# Altium schematic sheet CAN_Module.SchDoc: MCP2515 CAN Bus Module
size A4; Date: 3/3/2026; Author: Yasir Shahzad; CompanyName: mastermind; DrawnBy: Yasir Shahzad; Organization: mastermind; Revision: 1.01; SheetNumber: 1; SheetTotal: 1
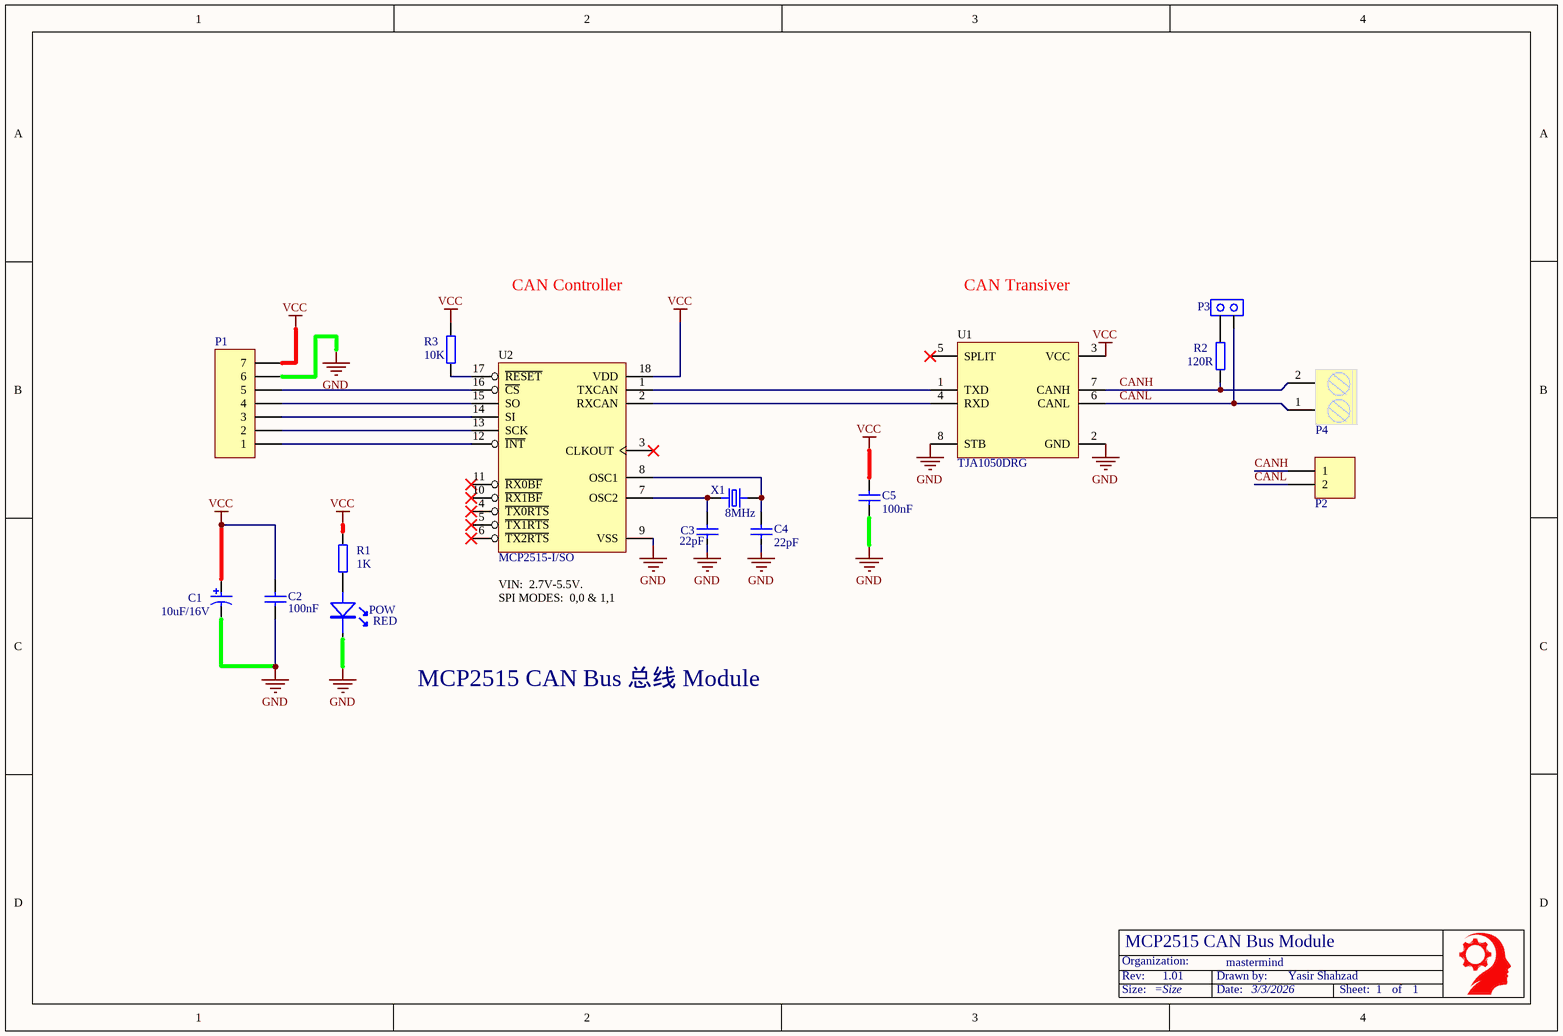
[diagram p0: CAN_Module.SchDoc]

## Parts
*  TitleBlock  (value not drawn)  (graphical)
C1  10uF/16V  [tantalum  A]  (value not drawn)
C2  100nF  [C0603]
C3  22pF  [C0603]
C4  22pF  [C0603]
C5  100nF  [C0603]
P1  Header 7  [HDR1X7]  (value not drawn)
P2  Header 2  [HDR1X2]  (value not drawn)
P3  Header 2  [HDR1X2]  (value not drawn)
P4  Terminal Block 3.5mmPitch: 3,5 mmNumber of pins: 2Created by Rembrandt Electronicswww.rembrandtelectronics.com  [TERMINAL-BLOCK-2-PIN-3.5MM-ROUND-PAD]  (value not drawn)
POW  RED  [CHIPLED_0603]
R1  1K  [R0603]
R2  120R  [R0603]
R3  10K  [R0603]
U1  TJA1050DRG  [SOIC-8E]
U2  MCP2515-I/SO  [SOIC-18_L11.6-W7.5-P1.27-LS10.3-BL]
X1  value 8MHz  [HC-49US_L11.5-W4.5-P4.88]  (hidden comment: PartNumber)

## Nets
GND: C1.2 C2.1 C3.2 C4.2 C5.1 P1.6 POW.C(K) U1.2(GND) U1.8(STB) U2.9(VSS)
VCC: C1.1 C2.2 C5.2 P1.7 R1.1 R3.2 U1.3(VCC) U2.18(VDD)
CANH: P2.1 P4.2 R2.1 U1.7(CANH)
CANL: P2.2 P3.1 P4.1 U1.6(CANL)
NetC3_1: C3.1 U2.7(OSC2) X1.2
NetC4_1: C4.1 U2.8(OSC1) X1.1
NetP1_1: P1.1 U2.12(~{INT})
NetP1_2: P1.2 U2.13(SCK)
NetP1_3: P1.3 U2.14(SI)
NetP1_4: P1.4 U2.15(SO)
NetP1_5: P1.5 U2.16(~{CS})
NetP3_2: P3.2 R2.2
NetPOW_A: POW.A R1.2
NetR3_1: R3.1 U2.17(~{RESET})
NetU1_1: U1.1(TXD) U2.1(TXCAN)
NetU1_4: U1.4(RXD) U2.2(RXCAN)

Not connected (* = marked no-connect by the designer): U1 5(SPLIT)*; U2 3(CLKOUT)* 4(~{TX0RTS})* 5(~{TX1RTS})* 6(~{TX2RTS})* 10(~{RX1BF})* 11(~{RX0BF})*

## Notes on the sheet
- CAN Controller
- CAN Transiver
- (near C1) 10uF/16V
- SPI MODES:  0,0 & 1,1
- (near U2) VIN:  2.7V-5.5V.
- MCP2515 CAN Bus 总线 Module
- (in symbol TitleBlock) Organization:; Rev:; Drawn by:; Size:; Date:; Sheet:; of

## Library data of the parts
* = TitleBlock: Title Block for Schematic Sheets
C1 = Cap_Tantalum: SMD Tantalum Capacitor
C2 C5 = Cap_0603: CAP CER 100nF 10V X7R 0603
C3 C4 = Cap_0603: CAP CER 22pF 10V X7R 0603
P1 = Header 7: Header, 7-Pin; LatestRevisionDate: 17-Jul-2002; LatestRevisionNote: Re-released for DXP Platform.; Publisher: Altium Limited
P2 = Header 2: Header, 2-Pin; LatestRevisionDate: 17-Jul-2002; LatestRevisionNote: Re-released for DXP Platform.; Publisher: Altium Limited
P3 = Header 2_J: Header, 2-Pin; LatestRevisionDate: 17-Jul-2002; LatestRevisionNote: Re-released for DXP Platform.; Publisher: Altium Limited
P4 = TERMINAL-3.50-2P: Screw Terminal 3.5mm; SymbolName_1: TERMINAL-BLOCK-PIN-3.5MM; GateName_1: -1
POW = LEDCHIP-LED0603: SMD lamp beads
R1 = Res_0603: RES SMD 1K OHM 1% 1/10W 0603
R2 = Res_0603: RES SMD 120 OHM 1% 1/10W 0603
R3 = Res_0603: RES SMD 10K OHM 1% 1/10W 0603
U1 = TJA1050DRG: CAN Transiver; Manufacturer: HGC(深圳汉芯); Add into BOM: yes; Symbol: TJA1050DRG; Device: TJA1050DRG; LCSC Part Name: TJA1050DRG; Supplier Part: C19723770; Manufacturer Part: TJA1050DRG; Supplier Footprint: SOP-8; JLCPCB Part Class: Extended Part; Datasheet: https://atta.szlcsc.com/upload/public/pdf/source/20231229/9EC40A6172CAB0350BF7AF3421F4DEBF.pdf; Supplier: LCSC; Convert to PCB: yes
U2 = MCP2515: CAN Controller; Manufacturer: Tokmas(托克马斯); Add into BOM: yes; Symbol: MCP2515-I; Device: MCP2515-I; Supplier: LCSC; Supplier Part: C5250735; Manufacturer Part: MCP2515-I; JLCPCB Part Class: Extended Part; LCSC Part Name: CAN芯片; Supplier Footprint: TSSOP-20; Datasheet: https://atta.szlcsc.com/upload/public/pdf/source/20221108/54102364C5045B746FF767DA10992A5D.pdf; Convert to PCB: yes
X1 = CRYSTAL-ECS-100-20-5PVX: 8MHz Â±30ppm Crystal 20pF 60 Ohms HC-49/US; MF: ECS Inc.; Availability: Warning; SnapEDA_Link: https://www.snapeda.com/parts/ECS-100-20-5PVX/ECS%20Inc./view-part/2721546/?ref=snap; MP: ECS-100-20-5PVX; Price: None; Package: HC49/US ECS International; Check_prices: https://www.snapeda.com/parts/ECS-100-20-5PVX/ECS%20Inc./view-part/2721546/?ref=eda